# EAGLE design Electronic_load (EAGLE 9.6.2)
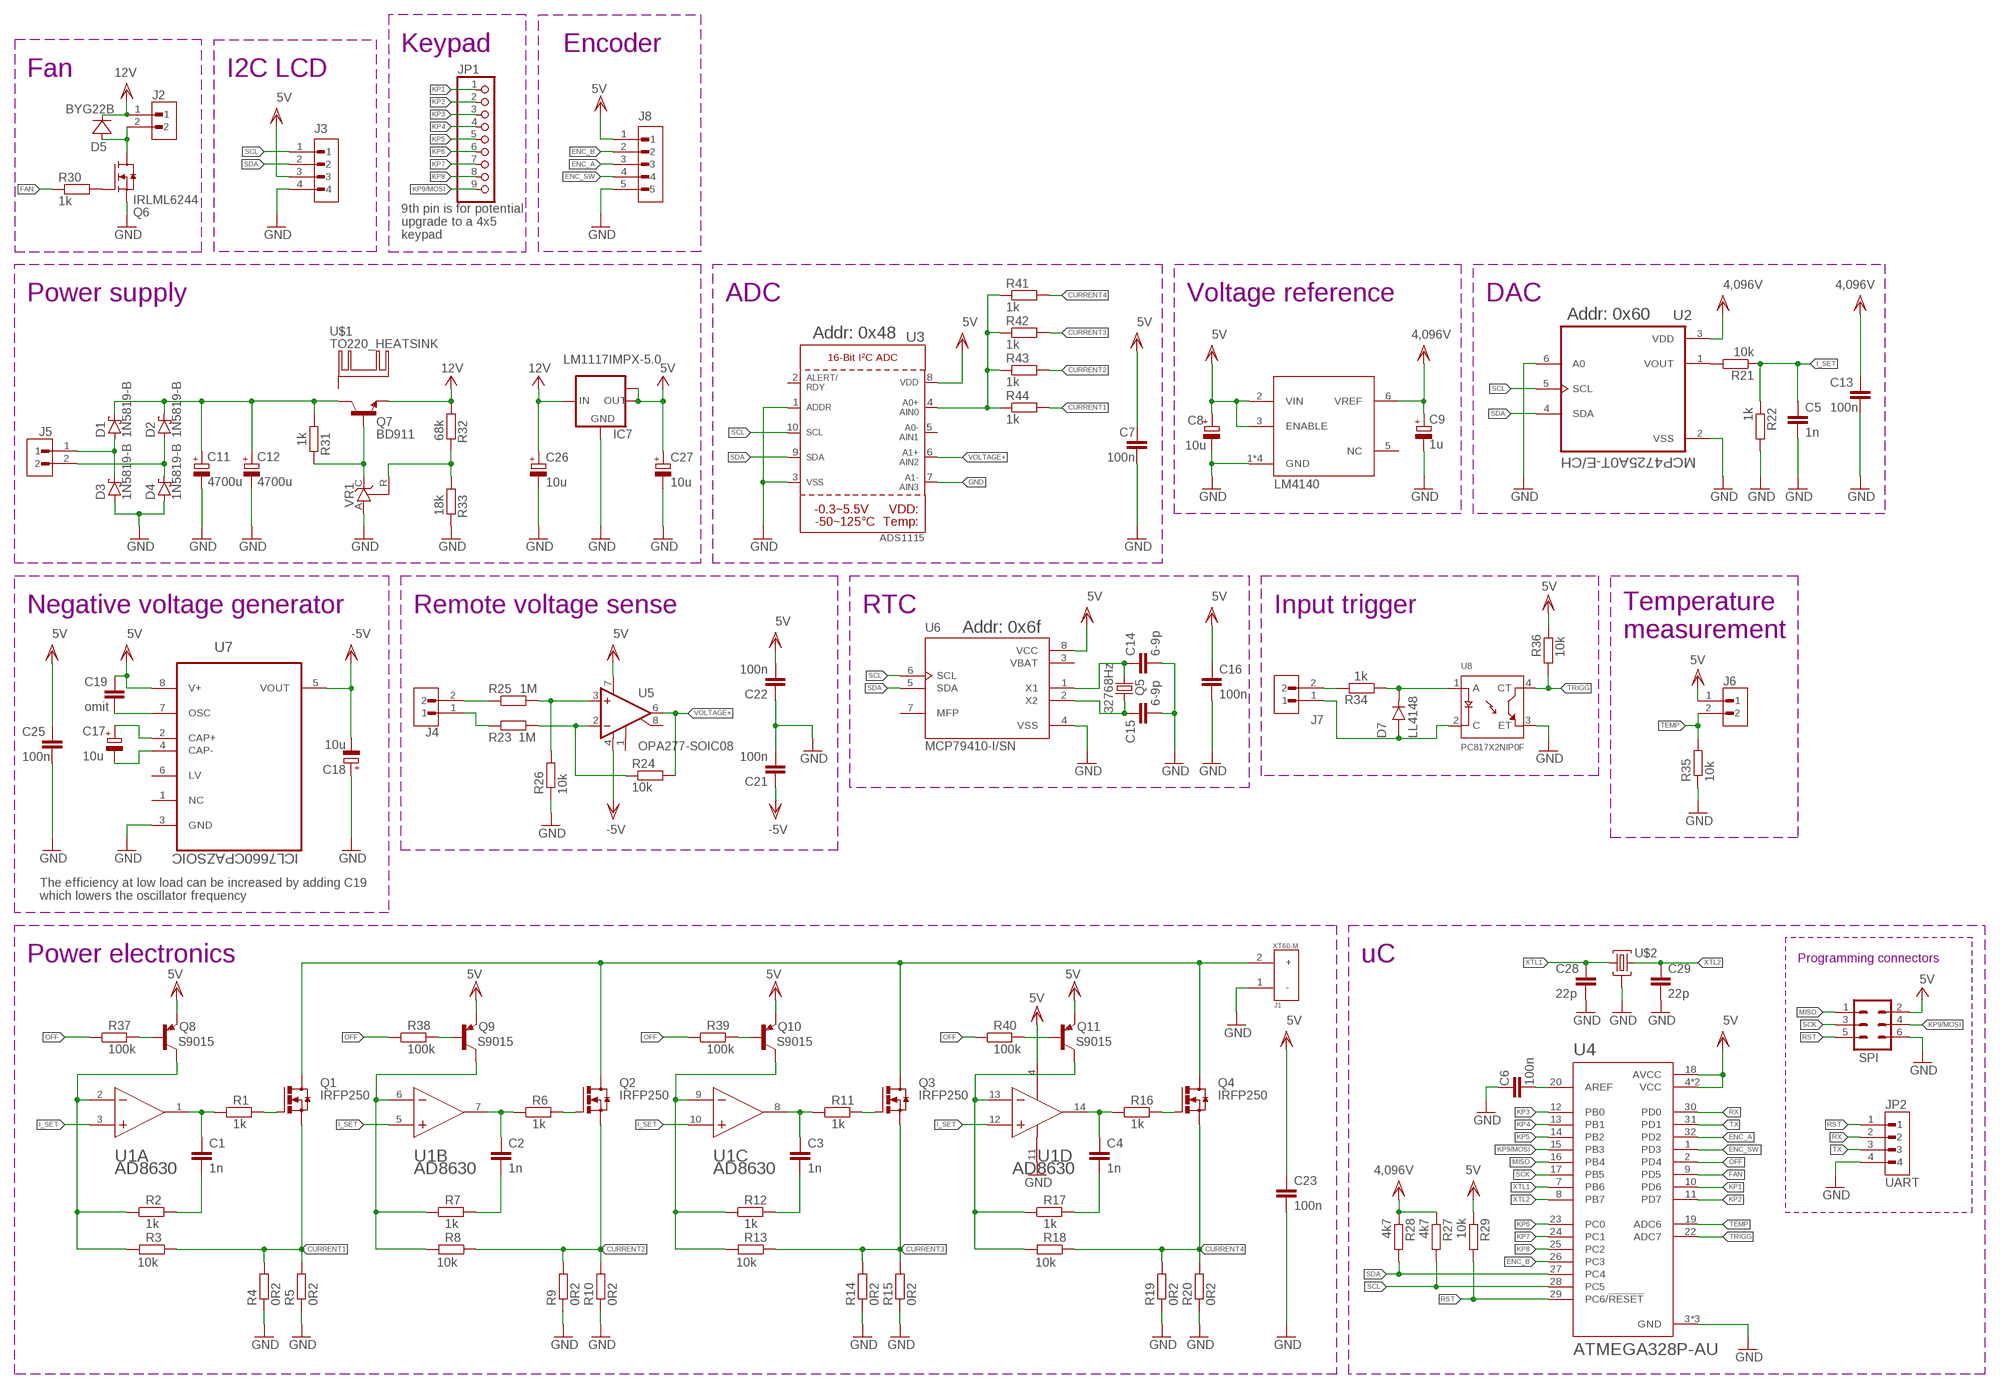
[diagram p0: schematic, sheet 1]

## Parts
C1  1n  C-EUC0603  [C0603]
C2  1n  C-EUC0603  [C0603]
C3  1n  C-EUC0603  [C0603]
C4  1n  C-EUC0603  [C0603]
C5  1n  C-EUC0603  [C0603]
C6  100n  C-EUC0603  [C0603]
C7  100n  C-EUC0603  [C0603]
C8  10u  CPOL-EUCT3528  [CT3528]
C9  1u  CPOL-EUCT3216  [CT3216]
C11  4700u  CPOL-EUE7.5-16  [E7,5-16]
C12  4700u  CPOL-EUE7.5-16  [E7,5-16]
C13  100n  C-EUC0603  [C0603]
C14  6-9p  C-EUC0603  [C0603]
C15  6-9p  C-EUC0603  [C0603]
C16  100n  C-EUC0603  [C0603]
C17  10u  CPOL-EUCT3528  [CT3528]
C18  10u  CPOL-EUCT3528  [CT3528]
C19  omit  C-EUC0603  [C0603]
C21  100n  C-EUC0603  [C0603]
C22  100n  C-EUC0603  [C0603]
C23  100n  C-EUC0603K  [C0603K]
C25  100n  C-EUC0603  [C0603]
C26  10u  CPOL-EUB/3528-21W  [B/3528-21W]
C27  10u  CPOL-EUB/3528-21W  [B/3528-21W]
C28  22p  C-EUC0603  [C0603]
C29  22p  C-EUC0603  [C0603]
D1  1N5819-B  [DO41-7.6]
D2  1N5819-B  [DO41-7.6]
D3  1N5819-B  [DO41-7.6]
D4  1N5819-B  [DO41-7.6]
D5  BYG22B  [DO-214AC]
D7  LL4148  [DIOMELF3515N]
IC7  LM1117IMPX-5.0  [SOT223]
J1  XT60-M  [AMASS_XT60-M]
J2  B2B-XH  [JST_B2B-XH-A(LF)(SN)]
J3  B4B-XH  [JST_B4B-XH-A(LF)(SN)]
J4  B2B-XH  [JST_B2B-XH-A(LF)(SN)]
J5  B2B-XH  [JST_B2B-XH-A(LF)(SN)]
J6  B2B-XH  [JST_B2B-XH-A(LF)(SN)]
J7  B2B-XH  [JST_B2B-XH-A(LF)(SN)]
J8  B5B-XH  [JST_B5B-XH-A(LF)(SN)]
JP1  PINHD-1X9  [1X09]
JP2  B4B-XH  [JST_B4B-XH-A(LF)(SN)]
Q1  IRFP250  [TO-247AD-V]
Q2  IRFP250  [TO-247AD-V]
Q3  IRFP250  [TO-247AD-V]
Q4  IRFP250  [TO-247AD-V]
Q5  32768Hz  CRYSTALTC26H  [TC26H]
Q6  IRLML6244  [SOT23]
Q7  BD911  [TO220V]
Q8  S9015  [SOT23]
Q9  S9015  [SOT23]
Q10  S9015  [SOT23]
Q11  S9015  [SOT23]
R1  1k  R-EU_R0805  [R0805]
R2  1k  R-EU_R0603  [R0603]
R3  10k  R-EU_R0603  [R0603]
R4  0R2  R-EU_R4527  [R4527]
R5  0R2  R-EU_R4527  [R4527]
R6  1k  R-EU_R0805  [R0805]
R7  1k  R-EU_R0603  [R0603]
R8  10k  R-EU_R0603  [R0603]
R9  0R2  R-EU_R4527  [R4527]
R10  0R2  R-EU_R4527  [R4527]
R11  1k  R-EU_R0805  [R0805]
R12  1k  R-EU_R0603  [R0603]
R13  10k  R-EU_R0603  [R0603]
R14  0R2  R-EU_R4527  [R4527]
R15  0R2  R-EU_R4527  [R4527]
R16  1k  R-EU_R0805  [R0805]
R17  1k  R-EU_R0603  [R0603]
R18  10k  R-EU_R0603  [R0603]
R19  0R2  R-EU_R4527  [R4527]
R20  0R2  R-EU_R4527  [R4527]
R21  10k  R-EU_R0603  [R0603]
R22  1k  R-EU_R0603  [R0603]
R23  1M  R-EU_R0603  [R0603]
R24  10k  R-EU_R0603  [R0603]
R25  1M  R-EU_R0603  [R0603]
R26  10k  R-EU_R0603  [R0603]
R27  4k7  R-EU_R0603  [R0603]
R28  4k7  R-EU_R0603  [R0603]
R29  10k  R-EU_R0603  [R0603]
R30  1k  R-EU_R0603  [R0603]
R31  1k  R-EU_R0805  [R0805]
R32  68k  R-EU_R0603  [R0603]
R33  18k  R-EU_R0603  [R0603]
R34  1k  R-EU_R0603  [R0603]
R35  10k  R-EU_R0603  [R0603]
R36  10k  R-EU_R0603  [R0603]
R37  100k  R-EU_R0603  [R0603]
R38  100k  R-EU_R0603  [R0603]
R39  100k  R-EU_R0603  [R0603]
R40  100k  R-EU_R0603  [R0603]
R41  1k  R-EU_R0603  [R0603]
R42  1k  R-EU_R0603  [R0603]
R43  1k  R-EU_R0603  [R0603]
R44  1k  R-EU_R0603  [R0603]
SPI  MA03-2  [MA03-2]
U1  ANALOG_DEVICES_AD8630ARZ-REEL7ANALOG_DEVICES_AD8630ARZ-REEL7_0_0  [ANALOG_DEVICES_AD8630ARZ-REEL7_0]
U2  MCP4725A0T-E/CH  [SOT95P270X145-6N]
U3  ADS1115  [MSOP10]
U4  ATMEGA328P-AU  [QFP80P900X900X120-32N]
U5  OPA277-SOIC08  [SOIC-08_150MIL]
U6  MCP79410-I/SN  [SOIC127P600X175-8N]
U7  ICL7660CPAZSOIC  [SOIC8]
U8  PC817X2NIP0F  [SOT254P975X400-4N]
U$1  TO220_HEATSINK  [TO220_HEATSINK]
U$2  CRYSTAL_3,4X2,7  [CRYSTAL_3,4X2,7]
U$3  LM4140  [SOIC8]
VR1  TL431CLP  [TO92-CLP]

## Nets
4,096V: C9.+ C13.1 R27.1 R28.1 U2.3(VDD) U$3.6(VREF) ; supply symbol labelled VDD
5V: C7.1 C8.+ C16.1 C19.1 C22.2 C23.1 C25.1 C27.+ IC7.2(OUT) IC7.TAB(OUT1) J3.3 J6.1 J8.1 Q8.2(E) Q9.2(E) Q10.2(E) Q11.2(E) R29.1 R36.2 SPI.2 U1.4(D:+V) U3.8(VDD) U4.4(VCC) U4.6(VCC) U4.18(AVCC) U5.7(V+) U6.8(VCC) U7.8(V+) U$3.2(VIN) U$3.3(ENABLE) ; supply symbol labelled VDD, VCC
12V: C26.+ D5.C IC7.3(IN) J2.1 Q7.3(E) R32.1 ; supply symbol labelled VDD, VCC
16V: C11.+ C12.+ D1.C D2.C Q7.2(C) R31.1
-5V: C18.- C21.1 U5.4(V-) U7.5(VOUT) ; supply symbol labelled VDD
AREF: C6.1 U4.20(AREF)
BASE: Q7.1(B) R31.2 VR1.C
CURRENT: R41.1 R42.1 R43.1 R44.1 U3.4(AIN0)
CURRENT1: Q1.S R3.1 R4.2 R5.2 R44.2
CURRENT2: Q2.S R8.1 R9.2 R10.2 R43.2
CURRENT3: Q3.S R13.1 R14.2 R15.2 R42.2
CURRENT4: Q4.S R18.1 R19.2 R20.2 R41.2
DAC_OUT: R21.2 U2.1(VOUT)
ENC_A: J8.3 U4.32(PD2)
ENC_B: J8.2 U4.26(PC3)
ENC_SW: J8.4 U4.1(PD3)
FAN: R30.1 U4.9(PD5)
GND: C5.2 C6.2 C7.2 C8.- C9.- C11.- C12.- C13.2 C14.2 C15.2 C16.2 C18.+ C21.2 C22.1 C23.2 C25.2 C26.- C27.- C28.2 C29.2 D3.A D4.A IC7.1(GND) J1.1(-) J3.4 J8.5 JP2.4 Q6.2(S) R4.1 R5.1 R9.1 R10.1 R14.1 R15.1 R19.1 R20.1 R22.2 R26.1 R33.2 R35.1 SPI.6 U1.11(D:-V) U2.2(VSS) U2.6(A0) U3.1(ADDR) U3.3(VSS) U3.7(AIN3) U4.3(GND) U4.5(GND) U4.21(GND) U6.4(VSS) U7.3(GND) U8.3(ET) U$2.GND U$2.GND2 U$3.1(GND) U$3.4(GND) U$3.7(GND) U$3.8(GND) VR1.A
I_SET: C5.1 R21.1 R22.1 U1.3(A:+IN_A) U1.5(B:+IN_B) U1.10(C:+IN_C) U1.12(D:+IN_D)
KP1: JP1.1 U4.10(PD6)
KP2: JP1.2 U4.11(PD7)
KP3: JP1.3 U4.12(PB0)
KP4: JP1.4 U4.13(PB1)
KP5: JP1.5 U4.14(PB2)
KP6: JP1.6 U4.23(PC0)
KP7: JP1.7 U4.24(PC1)
KP8: JP1.8 U4.25(PC2)
KP9/MOSI: JP1.9 SPI.4 U4.15(PB3)
MISO: SPI.1 U4.16(PB4)
N$1: D7.C(K) R34.1 U8.1(A)
N$2: R25.2 R26.2 U5.3(+IN)
N$3: C1.2 R2.2
N$4: C1.1 R1.1 U1.1(A:OUT_A)
N$5: Q1.G R1.2
N$6: Q8.3(C) R2.1 R3.2 U1.2(A:-IN_A)
N$7: J7.2 R34.2
N$8: J1.2(+) Q1.D Q2.D Q3.D Q4.D
N$9: C2.2 R7.2
N$10: C2.1 R6.1 U1.7(B:OUT_B)
N$11: Q2.G R6.2
N$12: Q8.1(B) R37.2
N$13: Q9.3(C) R7.1 R8.2 U1.6(B:-IN_B)
N$14: R23.2 R24.1 U5.2(-IN)
N$15: C3.2 R12.2
N$16: C3.1 R11.1 U1.8(C:OUT_C)
N$17: Q3.G R11.2
N$18: Q10.3(C) R12.1 R13.2 U1.9(C:-IN_C)
N$20: C4.2 R17.2
N$21: C4.1 R16.1 U1.14(D:OUT_D)
N$22: Q4.G R16.2
N$23: Q11.3(C) R17.1 R18.2 U1.13(D:-IN_D)
N$24: D5.A J2.2 Q6.3(D)
N$25: J4.2 R25.1
N$26: J4.1 R23.1
N$27: D1.A D3.C J5.1
N$28: D2.A D4.C J5.2
N$30: Q6.1(G) R30.2
N$31: C17.+ U7.2(CAP+)
N$32: C17.- U7.4(CAP-)
N$33: C14.1 Q5.2 U6.1(X1)
N$34: C15.1 Q5.1 U6.2(X2)
N$35: C19.2 U7.7(OSC)
N$37: Q9.1(B) R38.2
N$38: R32.2 R33.1 VR1.R
N$40: Q10.1(B) R39.2
N$42: Q11.1(B) R40.2
OFF: R37.1 R38.1 R39.1 R40.1 U4.2(PD4)
RST: JP2.1 R29.2 SPI.5 U4.29(PC6/!RESET)
RX: JP2.2 U4.30(PD0)
SCK: SPI.3 U4.17(PB5)
SCL: J3.1 R27.2 U2.5(SCL) U3.10(SCL) U4.28(PC5) U6.6(SCL)
SDA: J3.2 R28.2 U2.4(SDA) U3.9(SDA) U4.27(PC4) U6.5(SDA)
T_GND: D7.A J7.1 U8.2(C)
TEMP: J6.2 R35.2 U4.19(ADC6)
TRIGG: R36.1 U4.22(ADC7) U8.4(CT)
TX: JP2.3 U4.31(PD1)
VOLTAGE+: R24.2 U3.6(AIN2) U5.6(OUT)
XTL1: C28.1 U4.7(PB6) U$2.CRST1
XTL2: C29.1 U4.8(PB7) U$2.CRST2
Unconnected: U3.2(ALERT/RDY) U3.5(AIN1) U5.1(CMP1) U5.8(CMP2) U6.7(MFP) U7.1(NC) U7.6(LV) U$1.P$1(K) U$3.5(NC)

## Notes on the sheet
- Keypad | Encoder
- Fan | I2C LCD
- 9th pin is for potential
  upgrade to a 4x5
  keypad
- Power supply | ADC | Voltage reference | DAC
- Addr: 0x60
- Addr: 0x48
- Negative voltage generator | Remote voltage sense | RTC | Input trigger
- Addr: 0x6f
- Temperature
  measurement
- The efficiency at low load can be increased by adding C19
  which lowers the oscillator frequency
- Power electronics | uC | Programming connectors
- UART

## Power pins joined to a net without a drawn wire
VBAT: U6.3(VBAT)

## Library data of the parts
C1-C7 C13-C16 C19 C21-C23 C25 C28 C29 = rcl:C-EU: CAPACITOR, European symbol; SPICEPREFIX: C
C8 C9 C11 C12 C17 C18 C26 C27 = rcl:CPOL-EU: POLARIZED CAPACITOR, European symbol; SPICEPREFIX: C
D1-D4 = diode:1N581*: 1.0A SCHOTTKY BARRIER RECTIFIER Source: http://www.diodes.com/datasheets/ds23001.pdf
D5 = BYG22B:BYG22B
D7 = diode:LL4148: Check availability <https://pricing.snapeda.com/parts/LL4148%20L1/Taiwan%20Semiconductor/view-part?ref=eda>; AVAILABILITY: In Stock; DESCRIPTION: MMELF, 100V, 0.15A, Switching Diode & Array; MF: Taiwan Semiconductor; MP: LL4148 L1; PACKAGE: MINI MELF-2 Taiwan Semiconductor; PRICE: None; PURCHASE-URL: https://pricing.snapeda.com/search/part/LL4148 L1/?ref=eda
IC7 = lm1117:LM1117IMPX-*
J1 = XT60-M:XT60-M: DC supply; XT60; male; PIN:2; for cable; soldered; 60A; 500V Check availability <https://pricing.snapeda.com/parts/XT60-M/AMASS/view-part?ref=eda>; AVAILABILITY: Not in stock; DESCRIPTION: Plug; DC supply; XT60; male; PIN: 2; for cable; soldered; 30A; 500V; MF: AMASS; MP: XT60-M; PACKAGE: Package; PRICE: None
J2 J4-J7 = jst connectors:B2B-XH: Connector Header Through Hole 2 position 0.098" (2.50mm) Check prices <https://pricing.snapeda.com/parts/B2B-XH-A%28LF%29%28SN%29/JST%20Sales/view-part?ref=eda> Check availability <https://pricing.snapeda.com/parts/B2B-XH-A%28LF%29%28SN%29/JST%20Sales/view-part?ref=eda>; AVAILABILITY: In Stock; DESCRIPTION: Connector Header Through Hole 2 position 0.098 (2.50mm); MF: JST Sales; MP: B2B-XH-A(LF)(SN); PACKAGE: None; PRICE: None; PURCHASE-URL: https://pricing.snapeda.com/search/part/B2B-XH-A(LF)(SN)/?ref=eda
J3 JP2 = jst connectors:B4B-XH: Check availability <https://pricing.snapeda.com/parts/B4B-XH-A%28LF%29%28SN%29/JST%20Sales%20America%20Inc./view-part?ref=eda>; AVAILABILITY: In Stock; DESCRIPTION: Connector Header Through Hole 4 position 0.098 (2.50mm); MF: JST Sales America Inc.; MP: B4B-XH-A(LF)(SN); PACKAGE: None; PRICE: None; PURCHASE-URL: https://pricing.snapeda.com/search/part/B4B-XH-A(LF)(SN)/?ref=eda
J8 = jst connectors:B5B-XH: Check availability <https://pricing.snapeda.com/parts/B5B-XH-A%28LF%29%28SN%29/JST%20Sales%20America%20Inc./view-part?ref=eda>; AVAILABILITY: In Stock; DESCRIPTION: Connector Header Through Hole 5 position 0.098 (2.50mm); MF: JST Sales America Inc.; MP: B5B-XH-A(LF)(SN); PACKAGE: None; PRICE: None; PURCHASE-URL: https://pricing.snapeda.com/search/part/B5B-XH-A(LF)(SN)/?ref=eda
JP1 = pinhead:PINHD-1X9: PIN HEADER
Q1-Q4 = transistor-power:IRFP25*: 33A/27A, 200V/150V, 0.085/0.012 Ohm, N-Channel Power MOSFET Source: Fairchild Semiconductor Corporation
Q5 = crystal:CRYSTAL: CRYSTAL; OC_FARNELL: unknown; OC_NEWARK: unknown
Q6 = IRLML6244:IRLML6244
Q7 = BD911:BD911
Q8-Q11 = transistors:S9015
R1-R44 = rcl:R-EU_: RESISTOR, European symbol; SPICEPREFIX: R
SPI = con-lstb:MA03-2: PIN HEADER; OC_FARNELL: unknown; OC_NEWARK: unknown
U1 = Analog Devices - AD8630ARZ-REEL7:ANALOG_DEVICES_AD8630ARZ-REEL7: ADI-ADxxxx_OPxxxx-X-14; AMPLIFIERS_PER_PACKAGE: 4; AUTOMOTIVE_QUALIFIED: Yes; CIIVA_IDS: 1328426; CODE__JEDEC: MS-012-AB; COMPONENT_LINK_1_DESCRIPTION: Manufacturer URL; COMPONENT_LINK_1_URL: http://www.analog.com/en/index.html; COMPONENT_LINK_3_DESCRIPTION: Package Specification; COMPONENT_LINK_3_URL: http://www.analog.com/static/imported-files/packages/PKG_PDF/SOIC_Narrow%20(R)/R_14.pdf; DATASHEET: http://www.analog.com/static/imported-files/data_sheets/AD8628_8629_8630.pdf; DATASHEET_VERSION: Rev. I; FOOTPRINT_VARIANT_NAME_0: Level C; FOOTPRINT_VARIANT_NAME_1: Level B; FOOTPRINT_VARIANT_NAME_2: Level A; IMPORTED: yes; IMPORTED_FROM: vault; IMPORT_TS: 1521865442; INPUT_BIAS_CURRENT: 100pA; INPUT_OFFSET_VOLTAGE: 1uV; IQ_AMP: 1.1mA; MF: Analog Devices; MOUNTING_TECHNOLOGY: Surface Mount; MPN: AD8630ARZ-REEL7; PACKAGE: R-14; PACKAGE_DESCRIPTION: 14-Pin Standard Small Outline Package, Body 8.65 x 3.9 mm, Pitch 1.27 mm; PACKAGE_VERSION: 060606-A; PREFIX: U; RELEASE_DATE: 1363252697; SLEW_RATE: 1V/us; SMALL_SIGNAL_BANDWIDTH: 2.5MHz; VAULT_GUID: 4DF6EAA5-C883-4861-981B-282889AF4750; VAULT_REVISION: C58A2A1F-5423-4A27-BFF4-8757EFB4F1C0; V_SPAN_MAX: 6V; V_SPAN_MIN: 2.7V
U2 = MCP4725A0T-E_CH:MCP4725A0T-E/CH: MCP4725 Series 1 Ch I2C EEPROM Memory 5.5 V 12-Bit D/A Converter SMT - SOT-23-6 Check availability <https://pricing.snapeda.com/parts/MCP4725A0T-E/CH/Microchip/view-part?ref=eda>; AVAILABILITY: In Stock; DESCRIPTION: 12 Bit Digital to Analog Converter 1 SOT-23-6; MF: Microchip; MP: MCP4725A0T-E/CH; PACKAGE: SOT-23-6 Microchip; PRICE: None; PURCHASE-URL: https://pricing.snapeda.com/search/part/MCP4725A0T-E/CH/?ref=eda
U3 = ADS1115:ADS1115: 16-Bit Del-Sig ADC Four single-ended inputs or two differential inputs Internal PGA I2C interface 2.0-5.5V Check availability <https://pricing.snapeda.com/parts/ADS1115/Texas%20Instruments/view-part?ref=eda>; AVAILABILITY: In Stock; DESCRIPTION: ADS1115 - 16 Bit 3.3k Samples per Second Analog to Digital Converter (ADC) Evaluation Board; MF: Texas Instruments; MP: ADS1115; PACKAGE: TFSOP-10 Texas Instruments; PRICE: None; PURCHASE-URL: https://pricing.snapeda.com/search/part/ADS1115/?ref=eda
U4 = ATMEGA328P-AU:ATMEGA328P-AU: ATmega Series 20 MHz 32 KB Flash 2 KB SRAM 8-Bit Microcontroller - TQFP-32 Check availability <https://pricing.snapeda.com/parts/ATMEGA328P-AU/Microchip%20Technology/view-part?ref=eda>; AVAILABILITY: In Stock; DESCRIPTION: AVR AVR® ATmega Microcontroller IC 8-Bit 20MHz 32KB (16K x 16) FLASH 32-TQFP (7x7); MF: Microchip Technology; MP: ATMEGA328P-AU; PACKAGE: TQFP-32 Microchip; PRICE: None; PURCHASE-URL: https://pricing.snapeda.com/search/part/ATMEGA328P-AU/?ref=eda
U5 = OPA277:OPA277: High Precision OPERATIONAL AMPLIFIERS REPLACES OP-07, OP-77, OP-177 Source: opa277.pdf Check availability <https://pricing.snapeda.com/parts/OPA277/Texas%20Instruments/view-part?ref=eda>; AVAILABILITY: In Stock; DESCRIPTION: Op Amp Single Low Offset Voltage Amplifier ±18V 8-Pin PDIP Tube; MF: Texas Instruments; MP: OPA277; PACKAGE: None; PRICE: None; PURCHASE-URL: https://pricing.snapeda.com/search/part/OPA277/?ref=eda; SPICEPREFIX: X
U6 = MCP79410-I_SN:MCP79410-I/SN: MCP79410 Series 5.5 V I2C Real-Time Clock/Calendar with EEPROM SRAM-SOIC-8 Check availability <https://pricing.snapeda.com/parts/MCP79410-I/SN/Microchip/view-part?ref=eda>; AVAILABILITY: In Stock; DESCRIPTION: Real Time Clock (RTC) IC Clock/Calendar 64B, 1Kb I²C, 2-Wire Serial 8-SOIC (0.154, 3.90mm Width); MF: Microchip; MP: MCP79410-I/SN; PACKAGE: SO-8 Microchip; PRICE: None; PURCHASE-URL: https://pricing.snapeda.com/search/part/MCP79410-I/SN/?ref=eda
U7 = ICL7660CPAZ:ICL7660CPAZ: CMOS Voltage Converters Check availability <https://pricing.snapeda.com/parts/ICL7660CPAZ/Renesas%20Electronics%20America%20Inc/view-part?ref=eda>
U8 = PC817X2NIP0F:PC817X2NIP0F: PC817 Series 1 Channel 80 V 5000 Vrms General Purpose Photocoupler - DIP-4 Check availability <https://pricing.snapeda.com/parts/PC817X2NIP0F/Sharp%20Microelectronics/view-part?ref=eda>; AVAILABILITY: In Stock; DESCRIPTION: Optoisolator Transistor Output 5000Vrms 1 Channel 4-SMD; MF: Sharp Microelectronics; MP: PC817X2NIP0F; PACKAGE: SMD-4 Sharp; PRICE: None; PURCHASE-URL: https://pricing.snapeda.com/search/part/PC817X2NIP0F/?ref=eda
U$1 = custom_heatsink:TO220_HEATSINK
U$2 = CRYSTAL_SMD_3,4x2.7mm:CRYSTAL_3,4X2,7
U$3 = voltage_references:LM4140
VR1 = tl431:TL431CLP: VOLTAGE REGULATOR

## Board
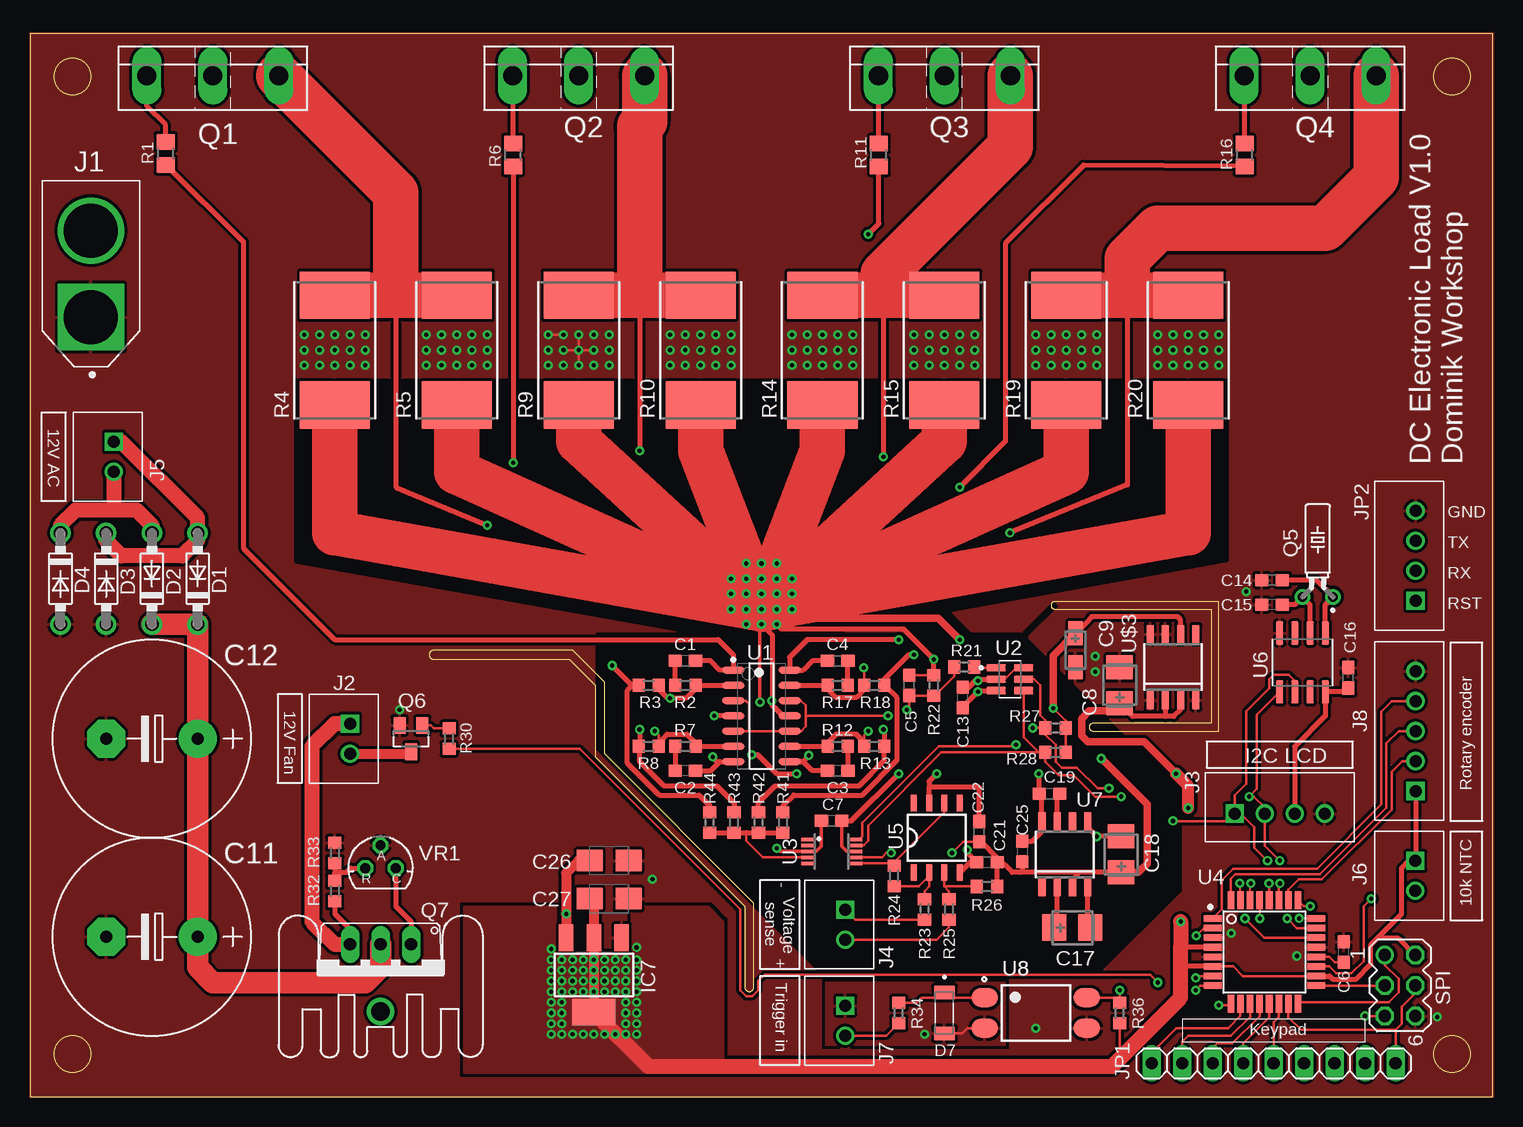
[diagram p1: board, top side]
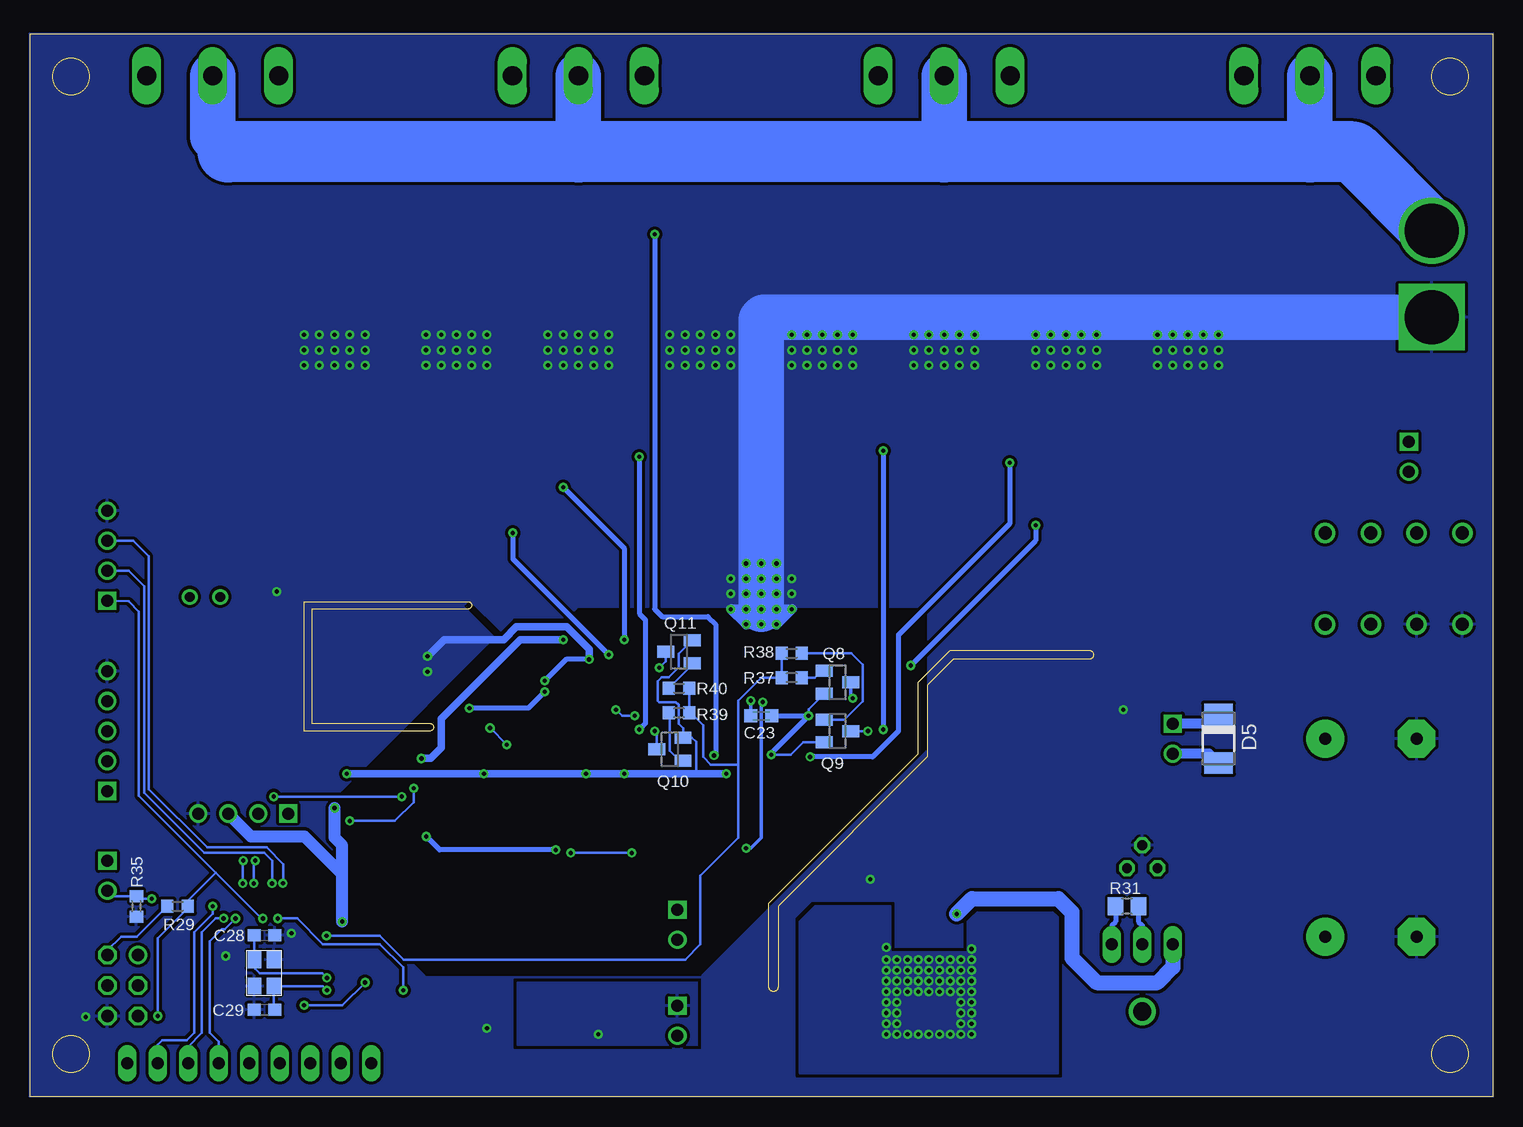
[diagram p2: board, bottom side, seen from below]

Size 121.9 x 88.57 mm. Coordinates in mm from the lower left corner, seen from the top.
Outline: 0,0 121.9,0 121.9,88.57 0,88.57 0,0
Outline: 33.66,36.45 44.96,36.45 47.12,34.29 47.12,28.32 59.56,15.88 59.56,9.14 arc90 59.94,8.76 arc90 60.33,9.14 60.33,16.13 47.88,28.57 47.88,34.54 45.21,37.21 33.66,37.21 arc90 33.27,36.83 arc90 33.66,36.45
Outline: 99.06,41.27 85.41,41.27 arc90 85.09,40.96 arc90 85.41,40.64 98.42,40.64 98.42,31.11 88.58,31.11 arc90 88.27,30.8 arc90 88.58,30.48 99.06,30.48 99.06,41.27
Outline: circle at 3.56,85.03 radius 1.53
Outline: circle at 3.56,3.56 radius 1.53
Outline: circle at 118.49,3.56 radius 1.53
Outline: circle at 118.49,85.03 radius 1.53
Copper layers (1*16): Top 0.035mm / dielectric 1.5mm / Bottom 0.035mm
Design rules "default *": minimum track width 6mil, minimum drill 0.35mm, track to track 6mil, track to pad 6mil, pad to pad 6mil, via to via 6mil, smd to smd 6mil, copper to edge 0mil, drill to drill 6mil, minimum pad ring 10mil, minimum via ring 8mil, stop-mask expansion 4mil, vias tented up to drill 14mil, thermal gap 10mil

### Footprints (pad centres in the part's own frame; a part is rotated, then mirrored left to right if it is on the bottom)
C0603 = smd 1.1 x 1: 1 -0.85,0; 2 0.85,0
CT3528 = smd 2 x 2.2: + -1.5,0; - 1.5,0
CT3216 = smd 2 x 1.2: + -1.4,0; - 1.4,0
E7,5-16 = drill 1.016 pad 3.15: + -3.81,0 | drill 1.016 pad 3.15 octagon: - 3.81,0
C0603K = smd 1.05 x 1.08: 1 -0.875,0; 2 0.875,0
B/3528-21W = smd 2.15 x 1.8: + 1.625,0; - -1.625,0
DO41-7.6 = drill 1.1 pad 1.7: A 3.81,0; C -3.81,0
DO-214AC = smd 1.8 x 2.4: A 2.025,0; C -2.025,0
DIOMELF3515N = smd 1.11 x 1.73: A 1.705,0; C -1.705,0
SOT223 = smd 1.219 x 2.235: 1 -2.311,-3.099; 2 0,-3.099; 3 2.311,-3.099 | smd 3.6 x 2.2: TAB 0,3.099
AMASS_XT60-M = drill 4.5 square: 1 -3.6,0 | drill 4.5: 2 3.6,0
JST_B2B-XH-A(LF)(SN) = drill 1 square: 1 1.25,0 | drill 1: 2 -1.25,0
JST_B4B-XH-A(LF)(SN) = drill 1 square: 1 -3.75,-0.525 | drill 1: 2 -1.25,-0.525; 3 1.25,-0.525; 4 3.75,-0.525
JST_B5B-XH-A(LF)(SN) = drill 1 square: 1 -5,-0.525 | drill 1: 2 -2.5,-0.525; 3 0,-0.525; 4 2.5,-0.525; 5 5,-0.525
1X09 = drill 1.016 long: 1 -10.16,0; 2 -7.62,0; 3 -5.08,0; 4 -2.54,0; 5 0,0; 6 2.54,0; 7 5.08,0; 8 7.62,0; 9 10.16,0
TO-247AD-V = drill 1.6 long: D 0,-2.54; G -5.5,-2.54; S 5.5,-2.54
TC26H = drill 0.813: 1 -1.27,0; 2 1.27,0
SOT23 = smd 1 x 1.4: 1 -0.95,-1.1; 2 0.95,-1.1; 3 0,1.1
TO220V = drill 1.016 long: 1 -2.54,-2.54; 2 0,-2.54; 3 2.54,-2.54
R0805 = smd 1.3 x 1.5: 1 -0.95,0; 2 0.95,0
R0603 = smd 1 x 1.1: 1 -0.85,0; 2 0.85,0
R4527 = smd 3.94 x 5.84: 1 -4.575,0; 2 4.575,0
MA03-2 = drill 1.016: 1 -2.54,-1.27 | drill 1.016 octagon: 2 -2.54,1.27; 3 0,-1.27; 4 0,1.27; 5 2.54,-1.27; 6 2.54,1.27
ANALOG_DEVICES_AD8630ARZ-REEL7_0 = smd 1.9 x 0.6: 1 -2.35,3.81; 2 -2.35,2.54; 3 -2.35,1.27; 4 -2.35,0; 5 -2.35,-1.27; 6 -2.35,-2.54; 7 -2.35,-3.81; 8 2.35,-3.81; 9 2.35,-2.54; 10 2.35,-1.27; 11 2.35,0; 12 2.35,1.27; 13 2.35,2.54; 14 2.35,3.81
SOT95P270X145-6N = smd 1.61 x 0.59: 1 -1.145,0.95; 2 -1.145,0; 3 -1.145,-0.95; 4 1.145,-0.95; 5 1.145,0; 6 1.145,0.95
MSOP10 = smd 0.3 x 1: 1 -1,-2.05; 2 -0.5,-2.05; 3 0,-2.05; 4 0.5,-2.05; 5 1,-2.05; 6 1,2.05; 7 0.5,2.05; 8 0,2.05; 9 -0.5,2.05; 10 -1,2.05
QFP80P900X900X120-32N = smd 1.5 x 0.55: 1 -4.3,2.8; 2 -4.3,2; 3 -4.3,1.2; 4 -4.3,0.4; 5 -4.3,-0.4; 6 -4.3,-1.2; 7 -4.3,-2; 8 -4.3,-2.8; 17 4.3,-2.8; 18 4.3,-2; 19 4.3,-1.2; 20 4.3,-0.4; 21 4.3,0.4; 22 4.3,1.2; 23 4.3,2; 24 4.3,2.8 | smd 0.55 x 1.5: 9 -2.8,-4.3; 10 -2,-4.3; 11 -1.2,-4.3; 12 -0.4,-4.3; 13 0.4,-4.3; 14 1.2,-4.3; 15 2,-4.3; 16 2.8,-4.3; 25 2.8,4.3; 26 2,4.3; 27 1.2,4.3; 28 0.4,4.3; 29 -0.4,4.3; 30 -1.2,4.3; 31 -2,4.3; 32 -2.8,4.3
SOIC-08_150MIL = smd 1.4 x 0.5: 1 -2.9,1.905; 2 -2.9,0.635; 3 -2.9,-0.635; 4 -2.9,-1.905; 5 2.9,-1.905; 6 2.9,-0.635; 7 2.9,0.635; 8 2.9,1.905
SOIC127P600X175-8N = smd 1.9 x 0.6: 1 -2.455,1.905; 2 -2.455,0.635; 3 -2.455,-0.635; 4 -2.455,-1.905; 5 2.455,-1.905; 6 2.455,-0.635; 7 2.455,0.635; 8 2.455,1.905
SOIC8 = smd 0.6 x 1.5: 1 -1.905,-2.75; 2 -0.635,-2.75; 3 0.635,-2.75; 4 1.905,-2.75; 5 1.905,2.75; 6 0.635,2.75; 7 -0.635,2.75; 8 -1.905,2.75
SOT254P975X400-4N = smd 2.25 x 1.6: 1 -4.25,1.27; 2 -4.25,-1.27; 3 4.25,-1.27; 4 4.25,1.27
TO220_HEATSINK = drill 1.524: P$1 0,0
CRYSTAL_3,4X2,7 = smd 1.4 x 1.15: CRST1 0,-1.6; CRST2 2.2,0; GND 0,0; GND2 2.2,-1.6
TO92-CLP = drill 0.813 octagon: A 0,1.905; C 1.27,0; R -1.27,0

### Placement (x,y rotation side)
C1  54.61,36.32 180 top
C2  54.61,27.18 180 top
C3  67.31,27.18 0 top
C4  67.31,36.32 0 top
C5  73.28,34.29 90 top
C6  109.47,12.06 90 top
C7  66.8,22.99 180 top
C8  90.81,34.29 90 top
C9  87.12,37.21 270 top
C11  10.16,13.34 180 top
C12  10.16,29.84 180 top
C13  77.72,33.27 90 top
C14  103.5,43.05 180 top
C15  103.5,41.02 180 top
C16  109.86,34.92 90 top
C17  86.87,14.1 0 top
C18  90.93,20.19 90 top
C19  84.96,25.27 0 top
C21  79.76,19.56 0 top
C22  79.12,22.1 90 top
C23  60.96,31.75 180 bottom
C25  82.68,20.45 270 top
C26  48.26,19.68 180 top
C27  48.26,16.51 180 top
C28  102.36,13.46 0 bottom
C29  102.36,7.24 180 bottom
D1  13.97,43.18 90 top
D2  10.16,43.18 90 top
D3  6.35,43.18 270 top
D4  2.54,43.18 270 top
D5  22.86,29.84 270 bottom
D7  76.2,6.99 270 top
IC7  46.99,10.16 180 top
J1  5.08,68.58 90 top
J2  26.67,29.84 90 top
J3  104.14,24.13 0 top
J4  67.94,14.35 90 top
J5  6.99,53.34 90 top
J6  115.44,18.41 90 top
J7  67.94,6.35 90 top
J8  114.94,30.48 90 top
JP1  103.63,2.79 0 top
JP2  114.94,45.09 90 top
Q1  15.24,87.63 0 top
Q2  45.72,87.63 0 top
Q3  76.2,87.63 0 top
Q4  106.68,87.63 0 top
Q5  107.31,41.66 0 top
Q6  31.75,29.84 180 top
Q7  29.21,10.16 180 top
Q8  54.61,34.54 270 bottom
Q9  54.61,30.48 270 bottom
Q10  68.58,28.96 90 bottom
Q11  67.82,37.08 90 bottom
R1  11.3,78.61 90 top
R2  54.61,34.29 180 top
R3  51.56,34.29 0 top
R4  25.4,62.23 90 top
R5  35.56,62.23 90 top
R6  40.26,78.49 90 top
R7  54.61,29.21 180 top
R8  51.56,29.21 0 top
R9  45.72,62.23 90 top
R10  55.88,62.23 90 top
R11  70.74,78.49 90 top
R12  67.31,29.21 0 top
R13  70.36,29.21 180 top
R14  66.04,62.23 90 top
R15  76.2,62.23 90 top
R16  101.22,78.49 90 top
R17  67.31,34.29 0 top
R18  70.36,34.29 180 top
R19  86.36,62.23 90 top
R20  96.52,62.23 90 top
R21  77.85,35.81 0 top
R22  75.31,34.29 90 top
R23  74.55,15.62 90 top
R24  72.01,18.41 90 top
R25  76.58,15.62 90 top
R26  79.76,17.53 180 top
R27  85.47,30.73 180 top
R28  85.47,28.7 180 top
R29  109.6,15.88 0 bottom
R30  34.92,29.84 90 top
R31  30.48,15.88 180 bottom
R32  25.4,17.14 90 top
R33  25.4,20.32 90 top
R34  72.39,6.99 270 top
R35  113.03,15.88 90 bottom
R36  90.81,6.99 270 top
R37  58.42,34.92 0 bottom
R38  58.42,36.96 0 bottom
R39  67.82,32 180 bottom
R40  67.82,34.04 180 bottom
R41  62.74,22.86 90 top
R42  60.71,22.86 90 top
R43  58.67,22.86 90 top
R44  56.64,22.86 90 top
SPI  114.17,9.27 270 top
U1  60.96,31.75 0 top
U2  81.66,34.8 0 top
U3  66.8,20.45 270 top
U4  102.87,12.06 0 top
U5  75.56,21.59 90 top
U6  106.05,36.2 270 top
U7  86.23,20.19 0 top
U8  83.82,6.99 0 top
U$1  29.21,7.11 0 top
U$2  101.6,11.43 270 bottom
U$3  95.25,35.81 0 top
VR1  29.21,19.05 0 top

### Tracks (layer width: path | path; a pad name or v marks a point on that pad's centre or on a via)
4,096V  (via drill 0.35)
  Top 0.203: v85.28,32.38 86.32,31.35 R27.1 R28.1
  Top 0.406: U2.3 79.08,33.85 v78.99,33.76 77.72,32.49 C13.1 | U$3.6 95.89,39.75 95.63,40.01 88.47,40.01 87.97,39.46 C9.+
  Top 0.61: v85.28,32.38 85.28,36.77 C9.+
  Bottom 0.406: v78.99,33.76 80.37,32.38 v85.28,32.38
5V  (via drill 0.35)
  Top 0.152: 115.46,19.68 J6.1
  Top 0.203: U4.6 100.26,10.87 101.06,10.06 U4.18 | R36.2 90.81,3.17 | 112.24,13.18 112.24,13.21
  Top 0.305: U3.8 68.07,20.45 67.65,20.87 C7.1
  Top 0.406: U1.4 v57.02,31.75 | v60.13,28.51 60.64,28.51 62.23,26.92 v63.88,26.92 | C7.1 68.45,22.99 v72.39,26.92 | U5.7 74.93,25.78 | 74.93,25.78 74.93,26.29 v75.56,26.92 | C22.2 79.12,25.78 74.93,25.78 | v84.07,26.92 84.11,26.89 C19.1 84.33,25.06 U7.8 84.33,22.1 83.53,21.3 C25.1 | C16.1 109.52,33.74 U6.8 107.95,31.75 105.39,29.19 J3.3 | U4.4 95.89,12.46 | U4.6 95.89,10.87 | U4.18 108.3,10.06 108.56,9.8 110.51,9.8 111.73,11.03 111.73,12.68 112.24,13.18 114.3,15.24 114.3,19.05 114.92,19.66 J6.1 | SPI.2 114.05,13.21 112.24,13.21 | U$3.2 94.61,31.7 | 94.61,31.7 91.89,31.7 C8.+ 90.17,32.16 | U$3.3 95.89,32.26 95.33,31.7 94.61,31.7 | J8.1 115.46,19.68
  Top 0.61: 90.17,32.16 88.29,32.16 87.63,31.5 87.63,30.1 88.14,29.59 92.84,29.59 v95.5,26.92
  Top 0.813: C27.+ 46.99,16.16 IC7.2 IC7.TAB
  Top 1.016: v96.52,24.06 96.52,25.91 v95.5,26.92
  Top 1.27: IC7.TAB 51.51,2.54 90.17,2.54 90.81,3.17 95.89,8.26 95.89,10.87 95.89,12.46 v95.89,14.61
  Bottom 0.203: Q9.2 57.47,29.53 58.48,28.51 v60.13,28.51 | Q8.2 57.02,32.28 v57.02,31.75 | Q11.2 67.82,36.93 67.82,35.81 68.67,34.97 69.27,34.97 69.6,34.64 69.6,33.02 69.47,32.89 68.07,32.89 67.85,32.67 67.85,31.09 67.48,30.73 Q10.2 66.74,29.91 66.4,29.57 66.4,27.2 66.67,26.92 | R29.1 112.99,13.34 114.3,13.34 115.44,12.19 SPI.2
  Bottom 0.406: v60.13,28.51 60.13,28.64 v57.02,31.75 C23.1
  Bottom 0.61: v95.5,26.92 v84.07,26.92 v75.56,26.92 v72.39,26.92 66.67,26.92 v63.88,26.92
  Bottom 1.016: J3.3 103.48,21.7 99.04,21.7 95.89,18.55 v95.89,14.61 95.89,20.95 96.52,21.59 v96.52,24.06
  other vias: 44.32,10.54 44.32,11.43 45.21,11.43 46.1,11.43 46.99,11.43 47.88,11.43 48.77,11.43 49.66,11.43 45.21,10.54 46.1,10.54 46.99,10.54 47.88,10.54 48.77,10.54 49.66,10.54 49.66,9.65 49.66,8.76 48.77,8.76 48.77,9.65 47.88,9.65 47.88,8.76 46.99,8.76 46.99,9.65 46.1,9.65 46.1,8.76 45.21,8.76 45.21,9.65 44.32,9.65 44.32,8.76 43.43,6.99 43.43,7.87 44.32,7.87 44.32,6.99 44.32,5.21 44.32,6.1 43.43,6.1 43.43,5.21 49.66,6.99 49.66,7.87 50.55,7.87 50.55,6.99 50.55,5.21 50.55,6.1 49.66,6.1 49.66,5.21 43.43,8.76 43.43,9.65 43.43,10.54 43.43,11.43 43.43,12.32 50.55,11.43 50.55,12.45 50.55,10.54 50.55,9.65 50.55,8.76 45.21,5.21 46.1,5.21 46.99,5.21 47.88,5.21 48.77,5.21
  pour Top (isolate 0.254, no thermals): 36.2,15.88 43.81,15.88 43.81,12.06 50.16,12.06 50.16,15.88 56.52,15.88 57.78,14.61 57.78,1.98 36.2,1.98
  pour Bottom (isolate 0.381, no thermals): 36.2,15.88 43.81,15.88 43.81,12.06 50.16,12.06 50.16,15.88 56.52,15.88 57.78,14.61 57.78,1.98 36.2,1.98
12V  (via drill 0.35)
  Top 0.406: R32.1 25.4,15.24 26.67,13.97 Q7.3
  Top 0.813: C26.+ 45.72,19.68 44.68,18.64 v44.68,15.24 IC7.3
  Top 1.27: J2.1 25.38,31.09 23.5,29.21 23.5,14.61 25.4,12.7 Q7.3
  Bottom 0.813: D5.C 23.64,31.09 J2.1
  Bottom 1.27: Q7.3 26.67,10.79 27.94,9.53 33.02,9.53 35.08,11.58 35.08,15.39 36.2,16.51 43.41,16.51 v44.68,15.24
16V
  Top 1.778: D2.C D1.C C12.+ C11.+ 13.97,10.79 15.24,9.53 27.94,9.53 29.21,10.79 Q7.2
  Bottom 0.406: R31.1 29.53,14.61 29.21,14.29 Q7.2
-5V  (via drill 0.35)
  Top 0.406: U5.4 78.34,19.56 C21.1 78.09,20.37 v78.09,20.57 | C18.- v88.88,21.69 88.14,22.43 U7.5
  Bottom 0.406: v78.09,20.57 87.76,20.57 v88.88,21.69
AREF
  Top 0.203: C6.1 108.71,11.21 108.26,11.66 U4.20
BASE
  Top 0.406: VR1.C 30.48,15.88 31.75,14.61 Q7.1
  Bottom 0.406: R31.2 31.43,14.61 31.75,14.29 Q7.1
CURRENT
  Top 0.203: U3.4 61.08,19.95 59.69,21.34 59.69,22.01
  Top 0.406: R44.1 R43.1 59.69,22.01 R42.1 R41.1
CURRENT1  (via drill 0.35)
  Top 0.406: 30.48,66.81 30.48,50.8 v38.1,47.62 | v48.51,35.94 50.16,34.29 R3.1 50.2,34.29 49.78,33.87 49.78,27.81 52.45,25.15 55.75,25.15 56.64,24.26 R44.2
  Top 3.81: R4.2 30.48,66.81 | 30.48,66.81 R5.2 | Q1.S 30.48,75.35 30.48,66.81
  Bottom 0.406: v48.51,35.94 38.1,46.35 v38.1,47.62
CURRENT2  (via drill 0.35)
  Top 0.406: 50.8,66.81 v50.8,53.85 | v50.8,30.61 50.8,29.3 | 50.8,29.3 R8.1 | 50.8,29.3 50.8,27.94 52.83,25.91 57.23,25.91 58.67,24.47 R43.2
  Top 3.81: R9.2 50.8,66.81 | R10.2 50.8,66.81 | Q2.S 51.22,81.28 50.8,80.86 50.8,66.81
  Bottom 0.406: v50.8,53.85 v50.8,30.61
CURRENT3  (via drill 0.35)
  Top 0.406: 71.12,66.81 v71.12,53.34 | v71.12,30.61 71.21,30.52 R13.1 71.21,28.03 69.09,25.91 62.1,25.91 60.71,24.51 R42.2
  Top 3.81: R14.2 71.12,66.81 | R15.2 71.12,66.81 | Q3.S 81.7,79.16 71.12,68.58 71.12,66.81
  Bottom 0.406: v71.12,30.61 70.61,31.11 70.61,39.75 71.12,40.26 v71.12,53.34
CURRENT4  (via drill 0.35)
  Top 0.406: v73.66,36.83 73.24,36.83 71.21,34.8 R18.1 72.26,33.23 72.26,28.07 69.34,25.15 63.63,25.15 62.74,24.26 R41.2 | 91.44,66.81 91.44,50.99 v81.66,46.99
  Top 3.81: R19.2 91.44,66.81 | 91.44,66.81 R20.2 | 91.44,66.81 91.44,69.85 93.98,72.39 107.95,72.39 112.18,76.62 Q4.S
  Bottom 0.406: v81.66,46.99 81.66,44.83 v73.66,36.83
DAC_OUT
  Top 0.203: U2.1 78.77,35.75 R21.2
ENC_A
  Top 0.203: U4.32 100.07,18.16 100.46,18.54 107.47,18.54 113.03,24.11 113.03,29.46 114.05,30.48 J8.3
ENC_B
  Top 0.203: U4.26 104.87,17.24 105.74,18.11 107.64,18.11 113.46,23.93 113.46,27.1 114.34,27.98 J8.2
ENC_SW
  Top 0.203: J8.4 113.5,32.98 112.62,32.11 112.62,24.36 107.26,19 100.28,19 99.33,18.05 99.33,15.63 U4.1
FAN  (via drill 0.35)
  Top 0.203: R30.1 45.81,29 59.18,15.62 59.18,8.89 59.69,8.38 60.2,8.38 60.71,8.89 60.71,9.65 61.21,10.16 93.34,10.16 v93.98,9.53 | v99.06,7.62 99.92,7.62 U4.9
  Bottom 0.203: v93.98,9.53 95.89,7.62 v99.06,7.62
GND  (via drill 0.35)
  Top 0.203: C5.2 R22.2 | U3.1 65.94,21.45 | U2.2 80.54,34.82 81.26,34.82 82.19,35.75 U2.6 | U3.7 71,19.95 71.37,20.32 v71.75,20.32 | C22.1 77.76,21.25 v76.83,20.32 | v43.18,63.5 v44.45,63.5 | v45.72,63.5 v45.72,62.23 | v45.72,62.23 v46.99,62.23 | v45.72,60.96 v45.72,62.23 | v44.45,62.23 v45.72,62.23
  Top 0.305: 65.95,21.46 65.95,20.87 65.53,20.45 U3.3 62.48,20.45 v62.23,20.7 | 65.95,21.46 C7.2 | 65.94,21.45 65.95,21.46 | v60.83,32.89 60.83,39.24 v60.96,39.37 | v61.83,33.02 61.85,33.02
  Top 0.406: v60.96,39.37 61.85,38.48 61.85,33.02 61.85,32.64 62.74,31.75 U1.11 | v60.96,40.64 62.61,38.99 72.77,38.99 v75.31,36.45 R22.2 | U2.2 79.12,34.8 v78.99,34.67 78.78,34.67 78.23,34.12 C13.2 | 80.61,19.94 C21.2 R26.1 | 80.61,19.94 79.3,21.25 C22.1 | 87.45,18.69 86.87,18.11 U7.3 | C18.+ 87.45,18.69 | 87.45,18.69 82.55,18.69 | 82.55,18.69 81.85,18.69 80.61,19.94 | 63.2,41.04 63.23,41.04 63.82,40.45 | C25.2 82.68,18.82 82.55,18.69
  Top 0.61: C18.+ 92.35,18.69 93.09,19.43 93.09,24.38 v89.28,28.19 | v77.47,38.1 75.69,39.88 64.39,39.88 63.82,40.45
  Top 3.81: v60.96,40.64 55.88,53.84 R10.1 | R14.1 66.04,53.84 v60.96,40.64 | v60.96,40.64 45.72,54.61 R9.1 | v60.96,40.64 76.2,54.61 R15.1 | v60.96,40.64 86.36,52.07 R19.1 | v60.96,40.64 63.2,41.04 96.52,46.99 R20.1 | R4.1 25.4,46.99 v60.96,40.64 | v60.96,40.64 35.56,52.07 R5.1
  Bottom 0.203: v71.75,20.32 v76.83,20.32
  Bottom 0.254: v62.23,40.64 v62.23,41.91 v62.23,43.18 | v62.23,43.18 v62.23,44.45 | v62.23,43.18 v60.96,43.18 v59.69,43.18 | v59.69,44.45 v59.69,43.18 | v59.69,43.18 v59.69,41.91 | v59.69,40.64 v60.96,41.91 v60.96,39.37
  Bottom 0.305: v62.23,20.7 61.85,20.7 60.96,21.59 60.96,32.77 v60.83,32.89 | C23.2 v61.83,33.02
  Bottom 0.406: v75.31,36.45 77.22,36.45 v78.99,34.67
  Bottom 0.61: v89.28,28.19 88.52,28.19 87.63,29.08 87.63,31.5 81.03,38.1 v77.47,38.1 | v75.31,36.45 75.31,37.29 77.17,39.16 81.37,39.16 82.42,38.1 87.38,38.1 v88.77,36.7
  Bottom 0.813: v63.5,40.64 v58.42,40.64 v59.69,39.37 v62.23,39.37 v63.5,40.64
  Bottom 3.81: J1.1 60.75,64.98 60.96,64.77 v60.96,43.18 v60.96,41.91 v60.96,40.64
  other vias: 22.86,63.5 24.13,63.5 25.4,63.5 26.67,63.5 27.94,63.5 27.94,62.23 26.67,62.23 24.13,62.23 22.86,62.23 22.86,60.96 24.13,60.96 25.4,60.96 26.67,60.96 27.94,60.96 33.02,60.96 34.29,60.96 35.56,60.96 36.83,60.96 38.1,60.96 38.1,62.23 36.83,62.23 34.29,62.23 35.56,62.23 33.02,62.23 33.02,63.5 34.29,63.5 35.56,63.5 36.83,63.5 38.1,63.5 46.99,63.5 48.26,63.5 48.26,62.23 43.18,62.23 43.18,60.96 44.45,60.96 46.99,60.96 48.26,60.96 53.34,63.5 54.61,63.5 55.88,63.5 57.15,63.5 58.42,63.5 58.42,62.23 57.15,62.23 55.88,62.23 54.61,62.23 53.34,62.23 53.34,60.96 54.61,60.96 55.88,60.96 57.15,60.96 58.42,60.96 93.98,63.5 95.25,63.5 96.52,63.5 97.79,63.5 99.06,63.5 99.06,62.23 97.79,62.23 95.25,62.23 93.98,62.23 93.98,60.96 95.25,60.96 96.52,60.96 97.79,60.96 99.06,60.96 83.82,63.5 85.09,63.5 86.36,63.5 87.63,63.5 88.9,63.5 88.9,62.23 87.63,62.23 85.09,62.23 83.82,62.23 83.82,60.96 85.09,60.96 86.36,60.96 87.63,60.96 88.9,60.96 86.36,62.23 96.52,62.23 73.66,63.5 74.93,63.5 76.2,63.5 77.47,63.5 78.74,63.5 78.74,62.23 77.47,62.23 74.93,62.23 73.66,62.23 73.66,60.96 74.93,60.96 76.2,60.96 77.47,60.96 78.74,60.96 76.2,62.23 63.5,63.5 64.77,63.5 66.04,63.5 67.31,63.5 68.58,63.5 68.58,62.23 67.31,62.23 64.77,62.23 63.5,62.23 63.5,60.96 64.77,60.96 66.04,60.96 67.31,60.96 68.58,60.96 66.04,62.23 25.4,62.23 60.96,44.45 58.42,43.18 58.42,41.91 63.5,41.91 63.5,43.18 30.8,32.26 100.11,13.64 101.35,42.1 83.82,5.71 51.87,18.14 105.58,11.73 117.26,6.65 88.77,35.43
  pour Bottom (isolate 0.254, rank 2): 0,88.65 0,0 121.92,0 121.92,88.65
  cutout Top: 22.23,44.6 22.23,59.69 99.69,59.69 99.69,44.73 60.94,37.73
  pour Top (isolate 0.254, rank 2): 0,88.65 121.92,88.65 121.92,0 0,0
  cutout Top: 69.85,39.37 72.77,39.37 74.04,38.1 78.74,38.1 76.2,40.64 69.85,40.64
  cutout Top: 47.24,38.58 47.24,28.96 66.04,10.16 88.9,10.16 95.89,17.14 95.89,25.4 82.7,38.58
  cutout Bottom: 47.24,40.64 47.24,28.96 66.04,10.16 88.9,10.16 95.89,17.14 95.89,25.4 81.53,39.75 77.09,39.75 76.2,40.64
  cutout Top: 82.8,38.73 85.28,41.21 85.6,40.89 83.12,38.42
  cutout Bottom: 82.8,38.73 85.28,41.21 85.6,40.89 83.12,38.42
I_SET  (via drill 0.35)
  Top 0.203: 59.94,30.48 59.94,32.74 59.66,33.02 U1.3 | 64.64,31.75 64.64,30.86 64.26,30.48 U1.10 59.94,30.48 | 64.64,31.75 64.64,32.61 64.23,33.02 U1.12 | R21.1 77,35.05 75.39,33.44 R22.1 C5.1 73.28,32.46 v73.07,32.26 | v71.5,31.75 66.67,31.75 64.64,31.75 | 59.94,30.48 U1.5
  Bottom 0.203: v73.07,32.26 72.56,31.75 v71.5,31.75
KP1
  Top 0.203: U4.10 100.87,6.74 99.85,5.71 95.5,5.71 93.47,3.68 JP1.1
KP2
  Top 0.203: U4.11 101.67,6.67 100.08,5.08 96.52,5.08 96.01,4.57 JP1.2
KP3
  Top 0.203: U4.12 102.47,6.71 100.2,4.45 98.93,4.45 98.55,4.06 JP1.3
KP4
  Top 0.203: U4.13 103.28,6.63 101.09,4.45 JP1.4
KP5
  Top 0.203: U4.14 104.07,6.66 103.63,6.22 JP1.5
KP6  (via drill 0.35)
  Top 0.203: U4.23 105.57,14.06 v104.78,14.86
  Bottom 0.203: v104.78,14.86 105.66,13.97 105.92,13.97 106.93,12.95 106.93,5.33 106.17,4.57 JP1.6
KP7  (via drill 0.35)
  Top 0.203: U4.24 v105.77,14.87 v105.77,14.86
  Bottom 0.203: v105.77,14.86 106.42,14.86 107.58,13.7 107.58,5.32 108.71,4.19 JP1.7
KP8  (via drill 0.35)
  Top 0.203: U4.25 106.16,15.88 v106.68,15.88
  Bottom 0.203: v106.68,15.88 106.68,15.24 108.21,13.71 108.21,5.33 108.84,4.7 110.87,4.7 111.25,4.32 JP1.8
KP9/MOSI
  Top 0.203: SPI.4 115.44,8.64 114.3,7.49 114.3,6.1 113.79,5.59 | 113.79,5.59 105.92,5.59 104.87,6.64 U4.15 | JP1.9 113.79,5.59
MISO
  Top 0.203: SPI.1 112.9,10.96 114.05,9.82 114.05,8.72 113.22,7.89 105.8,7.89 U4.16
N$1
  Top 0.152: D7.C 76.2,8.26
  Top 0.203: R34.1 73.88,7.83 74.3,8.26 76.2,8.26 U8.1
N$2
  Top 0.203: R25.2 76.58,17.14 76.2,17.53 | 76.2,17.53 U5.3 | R26.2 76.2,17.53
N$3
  Top 0.406: R2.2 C1.2
N$4
  Top 0.406: C1.1 56.73,36.32 57.49,35.56 U1.1 58.61,36.83 57.34,38.1 25.4,38.1 17.78,45.72 17.78,71.27 R1.1
N$5
  Top 0.406: R1.2 11.3,80.99 9.74,82.55 Q1.G
N$6  (via drill 0.35)
  Top 0.305: v53.34,33.21 53.34,33.27
  Top 0.406: U1.2 R2.1 55.46,34 54.74,33.27 53.34,33.27 53.09,33.27 52.41,33.95 R3.2
  Bottom 0.305: Q8.3 53.51,33.38 v53.34,33.21
N$7
  Top 0.203: J7.2 71.36,5.1 R34.2
N$8
  Bottom 3.81: 105.41,78.74 106.68,80.01 Q4.D | Q3.D 76.2,78.74 | Q2.D 45.72,78.74 | Q1.D 15.24,78.74
  Bottom 5.08: 105.41,78.74 76.2,78.74 45.72,78.74 15.24,78.74 11.64,78.74 J1.2
N$9
  Top 0.406: R7.2 C2.2
N$10  (via drill 0.35)
  Top 0.406: 57.49,27.94 56.73,27.18 C2.1 | 57.49,27.94 U1.7 | 57.49,27.94 57.28,27.94 v56.9,28.32 | R6.1 v40.26,52.83
  Bottom 0.406: v40.26,52.83 40.26,47.75 49.53,38.48 49.53,30.48 51.69,28.32 v56.9,28.32
N$11
  Top 0.406: R6.2 40.26,85.05 Q2.G
N$12
  Bottom 0.203: Q8.1 55.95,35.49 56.52,34.92 R37.2
N$13  (via drill 0.35)
  Top 0.203: v52.07,30.48 52.41,30.14 R8.2
  Top 0.406: U1.6 R7.1 55.46,29.5 54.74,30.23 53.09,30.23 52.41,29.55 R8.2
  Bottom 0.203: Q9.3 v52.07,30.48
N$14
  Top 0.203: R23.2 74.55,17.14 74.93,17.53 74.93,18.41 | 74.93,18.41 U5.2 | R24.1 74.08,17.57 74.93,18.41
N$15
  Top 0.406: R12.2 C3.2
N$16  (via drill 0.35)
  Top 0.406: C3.1 65.19,27.18 64.43,27.94 U1.8 64.39,27.94 v64.9,28.45 | v69.85,71.88 70.74,72.77 R11.1
  Bottom 0.406: v64.9,28.45 64.77,28.57 64.77,39.37 65.41,40.01 69.22,40.01 69.85,40.64 v69.85,71.88
N$17
  Top 0.406: R11.2 70.74,85.05 Q3.G
N$18  (via drill 0.35)
  Top 0.203: v69.85,30.48 69.51,30.14 R13.2
  Top 0.406: U1.9 R12.1 66.46,29.5 67.18,30.23 68.83,30.23 69.51,29.55 R13.2
  Bottom 0.203: Q10.3 69.68,30.31 v69.85,30.48
N$20
  Top 0.406: R17.2 C4.2
N$21  (via drill 0.35)
  Top 0.406: C4.1 65.19,36.32 64.43,35.56 U1.14 63.31,36.64 64.77,38.1 v72.39,38.1 | R16.1 87.81,77.65 81.28,71.12 81.28,54.61 v77.47,50.8
  Bottom 0.406: v77.47,50.8 72.39,45.72 v72.39,38.1
N$22
  Top 0.406: R16.2 101.22,85.05 Q4.G
N$23  (via drill 0.35)
  Top 0.203: v69.47,35.75 69.51,35.71 R18.2
  Top 0.406: R17.1 66.17,34.29 | U1.13 66.17,34.29 | R18.2 69.51,33.95 68.83,33.27 67.18,33.27 66.17,34.29
  Bottom 0.203: Q11.3 68.92,36.3 v69.47,35.75
N$24
  Top 0.813: J2.2 31.6,28.59 Q6.3
  Bottom 0.813: D5.A 23.64,28.59 J2.2
N$25
  Top 0.203: J4.2 75.55,13.1 76.58,14.14 R25.1
N$26
  Top 0.203: R23.1 68.78,14.77 J4.1
N$27
  Top 1.27: D3.C 6.35,46.35 7.62,45.09 12.7,45.09 13.97,46.35 D1.A 13.97,48.24 7.62,54.59 J5.1
N$28
  Top 1.27: D2.A 10.16,47.62 8.89,48.9 6.99,48.9 | 6.99,48.9 3.81,48.9 2.54,47.62 D4.C | J5.2 6.99,48.9
N$30
  Top 0.203: Q6.1 33.41,30.95 33.66,30.7 R30.2
N$31
  Top 0.406: C17.+ 85.6,14.33 U7.2
N$32
  Top 0.406: C17.- 88.14,14.33 U7.4
N$33
  Top 0.406: U6.1 107.95,41.02 Q5.2 107.19,43.05 C14.1
N$34
  Top 0.406: U6.2 106.68,41.02 Q5.1 105.41,41.02 C15.1
N$35
  Top 0.406: U7.7 85.6,25.06 C19.2
N$37
  Bottom 0.203: Q9.1 54.04,31.43 52.51,32.97 52.51,35.99 53.47,36.96 R38.2
N$38
  Top 0.406: R32.2 25.4,18.73 | 25.4,18.73 26.42,18.73 26.73,19.05 VR1.R | R33.1 25.4,18.73
N$40
  Bottom 0.203: Q10.1 67.73,28.01 68.58,28.85 68.58,31.92 R39.2
N$42
  Bottom 0.203: R40.2 66.72,35.99 Q11.1
OFF  (via drill 0.35)
  Top 0.203: v97.19,13.43 97.83,14.06 U4.2
  Bottom 0.203: R38.1 R37.1 60.96,34.92 62.87,33.02 62.87,27.69 | R40.1 R39.1 66.84,32 65.79,30.95 65.79,28.32 65.15,27.69 62.87,27.69 | 62.87,27.69 62.87,21.59 66.04,18.41 66.04,12.7 67.31,11.43 90.75,11.43 92.74,13.43 v97.19,13.43
RST  (via drill 0.35)
  Top 0.203: U4.29 102.47,14.88 v102.49,14.86 | SPI.5 v111.25,6.73
  Bottom 0.203: 106.43,18.67 108.75,16.34 R29.2 108.75,15.71 111.25,13.21 v111.25,6.73 | v102.49,14.86 102.62,14.86 106.43,18.67 | 106.43,18.67 112.83,25.07 112.83,40.44 113.68,41.29 JP2.1
RX  (via drill 0.35)
  Top 0.152: U4.30 101.67,17.72 v101.73,17.78
  Bottom 0.152: v101.73,17.78
  Bottom 0.203: v101.73,17.78 101.73,19.65 102.39,20.32 107.39,20.32 112.39,25.32 112.39,42.55 113.67,43.82 JP2.2
SCK
  Top 0.203: SPI.3 U4.17
SCL  (via drill 0.35)
  Top 0.152: v103.25,17.78 103.27,17.76
  Top 0.203: U2.5 83.69,34.8 84.2,34.29 84.2,31.79 84.62,31.37 R27.2 | U3.10 69.11,21.45 69.36,21.7 69.36,22.84 75.73,29.21 82.04,29.21 v82.17,29.34 | R27.2 v83.57,30.73 | R27.2 84.62,30.18 85.47,29.32 85.47,27.94 85.98,27.43 87.25,27.43 88.97,25.71 v89.92,25.71 | J3.1 100.9,23.61 102.04,22.46 102.04,20.77 v103.12,19.68 | J3.1 100.39,25.13 101.35,26.09 101.35,32.13 103.25,34.04 103.25,34.8 103.63,35.18 104.9,35.18 105.41,34.67 U6.6 | J3.1 99.75,22.97 95.27,22.97 v95.25,22.99 | 103.27,17.76 U4.28
  Bottom 0.203: v83.57,30.73 v82.17,29.34 | v89.92,25.71 89.92,24.57 91.49,22.99 v95.25,22.99 | v103.12,19.68 103.25,19.56 v103.25,17.78
SDA  (via drill 0.35)
  Top 0.203: U2.4 82.8,29.97 84.07,28.7 | 84.07,28.7 R28.2 84.62,27.9 85.72,26.8 87,26.8 88.77,25.02 v90.93,25.02 | U3.9 69.46,20.95 69.85,21.34 69.85,22.61 75.95,28.7 84.07,28.7 | U6.5 102.23,31.84 102.23,25.65 v101.6,25.02 101.98,25.02 102.89,24.11 J3.2 102.89,21.82 102.89,20.93 v104.14,19.68 | v104.16,17.78 104.07,17.69 U4.27
  Bottom 0.203: v101.6,25.02 v90.93,25.02 | v104.16,17.78 104.16,19.66 v104.14,19.68
T_GND  (via drill 0.35)
  Top 0.203: U8.2 78.11,5.71 77.67,5.28 D7.A
  other vias: 74.55,5.21
  pour Top (isolate 0.254): 66.29,4.32 81.28,4.32 81.28,9.53 66.29,9.53
  pour Bottom (isolate 0.254): 66.29,9.53 81.28,9.53 81.28,4.32 66.29,4.32
TEMP  (via drill 0.35)
  Top 0.203: U4.19 108.26,10.87 108.84,10.29 110.11,10.29 111.12,11.3 111.12,15.88 v111.76,16.51
  Bottom 0.203: J6.2 115,16.73 R35.2 112.81,16.51 v111.76,16.51
TRIGG  (via drill 0.35)
  Top 0.203: U8.4 90.39,8.26 R36.1 v90.81,8.89 | U4.22 102.84,13.27 v101.25,14.86
  Bottom 0.203: v90.81,8.89 90.81,10.79 92.73,12.72 97.5,12.72 99.63,14.86 v101.25,14.86
TX  (via drill 0.35)
  Top 0.152: U4.31 100.87,17.75 v100.82,17.8
  Bottom 0.152: v100.82,17.8 100.79,17.83
  Bottom 0.203: JP2.3 113.28,46.35 111.99,45.06 111.99,25.63 107.14,20.78 102.19,20.78 100.79,19.37 100.79,17.83
VOLTAGE+
  Top 0.203: U3.6 71.92,19.45 | U5.6 76.2,23.73 71.92,19.45 | R24.2 71.92,19.36 71.92,19.45
XTL1  (via drill 0.35)
  Top 0.203: v97.16,9.91 97.31,10.06 U4.7
  Bottom 0.203: C28.1 103.21,11.44 U$2.CRST1 103.12,11.35 103.12,10.67 102.74,10.29 97.54,10.29 v97.16,9.91
XTL2  (via drill 0.35)
  Top 0.203: v97.16,8.89 97.53,9.27 U4.8
  Bottom 0.203: C29.1 101.6,7.33 U$2.CRST2 97.5,9.23 v97.16,8.89

### Text on the board
tPlace: 12V AC | GND | TX | RX | RST | 12V Fan | I2C LCD | Rotary encoder | - | Voltage / sense | 10k NTC | + | Trigger in | Keypad
tNames: DC Electronic Load V1.0 / Dominik Workshop